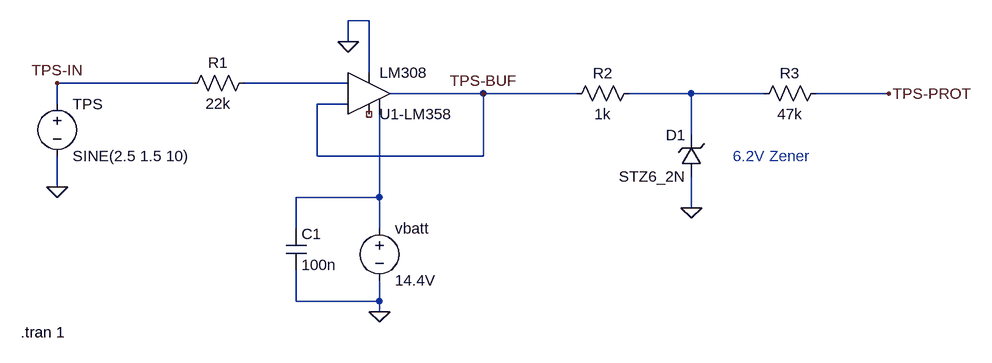
[diagram p0: schematic tps-sensor.asc]
tps-sensor.asc, the LTspice schematic file:
Version 4
SHEET 1 880 680
WIRE -14800 -1440 -14832 -1440
WIRE -14832 -1408 -14832 -1440
WIRE -14800 -1360 -14800 -1440
WIRE -15072 -1344 -15280 -1344
WIRE -14832 -1344 -14992 -1344
WIRE -14624 -1328 -14768 -1328
WIRE -14480 -1328 -14624 -1328
WIRE -14304 -1328 -14400 -1328
WIRE -14192 -1328 -14304 -1328
WIRE -14000 -1328 -14112 -1328
WIRE -15280 -1312 -15280 -1344
WIRE -14832 -1312 -14880 -1312
WIRE -14304 -1264 -14304 -1328
WIRE -14880 -1232 -14880 -1312
WIRE -14624 -1232 -14624 -1328
WIRE -14624 -1232 -14880 -1232
WIRE -15280 -1184 -15280 -1232
WIRE -14784 -1168 -14784 -1296
WIRE -14784 -1168 -14912 -1168
WIRE -14304 -1152 -14304 -1200
WIRE -14912 -1120 -14912 -1168
WIRE -14784 -1120 -14784 -1168
WIRE -14912 -1008 -14912 -1056
WIRE -14784 -1008 -14784 -1040
WIRE -14784 -1008 -14912 -1008
WIRE -14784 -992 -14784 -1008
FLAG -15280 -1184 0
FLAG -14832 -1408 0
FLAG -14784 -992 0
FLAG -14304 -1152 0
FLAG -15280 -1344 TPS-IN
FLAG -14624 -1328 TPS-BUF
FLAG -14000 -1328 TPS-PROT
SYMBOL res -14976 -1360 R90
WINDOW 0 0 56 VBottom 2
WINDOW 3 32 56 VTop 2
SYMATTR InstName R1
SYMATTR Value 22k
SYMBOL res -14384 -1344 R90
WINDOW 0 0 56 VBottom 2
WINDOW 3 32 56 VTop 2
SYMATTR InstName R2
SYMATTR Value 1k
SYMBOL OpAmps\\LM308 -14800 -1264 M180
SYMATTR InstName U1-LM358
SYMBOL voltage -15280 -1328 R0
WINDOW 123 0 0 Left 0
WINDOW 39 0 0 Left 0
SYMATTR InstName TPS
SYMATTR Value SINE(2.5 1.5 10)
SYMBOL voltage -14784 -1136 R0
WINDOW 123 0 0 Left 0
WINDOW 39 0 0 Left 0
SYMATTR InstName vbatt
SYMATTR Value 14.4V
SYMBOL cap -14928 -1120 R0
SYMATTR InstName C1
SYMATTR Value 100n
SYMBOL zener -14288 -1200 R180
WINDOW 0 24 64 Left 2
WINDOW 3 24 0 Left 2
SYMATTR InstName D1
SYMATTR Value STZ6_2N
SYMBOL res -14096 -1344 R90
WINDOW 0 0 56 VBottom 2
WINDOW 3 32 56 VTop 2
SYMATTR InstName R3
SYMATTR Value 47k
TEXT -15336 -960 Left 2 !.tran 1
TEXT -14240 -1232 Left 2 ;6.2V Zener

The netlist it stands for:
* tps-sensor.asc
R1 N001 TPS-IN 22k
R2 N002 TPS-BUF 1k
XU1-LM358 N001 TPS-BUF N003 0 TPS-BUF NC_01 NC_02 LT1008
V§TPS TPS-IN 0 SINE(2.5 1.5 10)
vbatt N003 0 14.4V
C1 N003 0 100n
D1 0 N002 STZ6_2N
R3 TPS-PROT N002 47k
.model D D
.lib standard.dio
.tran 1
* 6.2V Zener
.lib LTC.lib
.backanno
.end